# EAGLE design CameraModul (EAGLE 9.4.2)

## Sheet 1 of 2
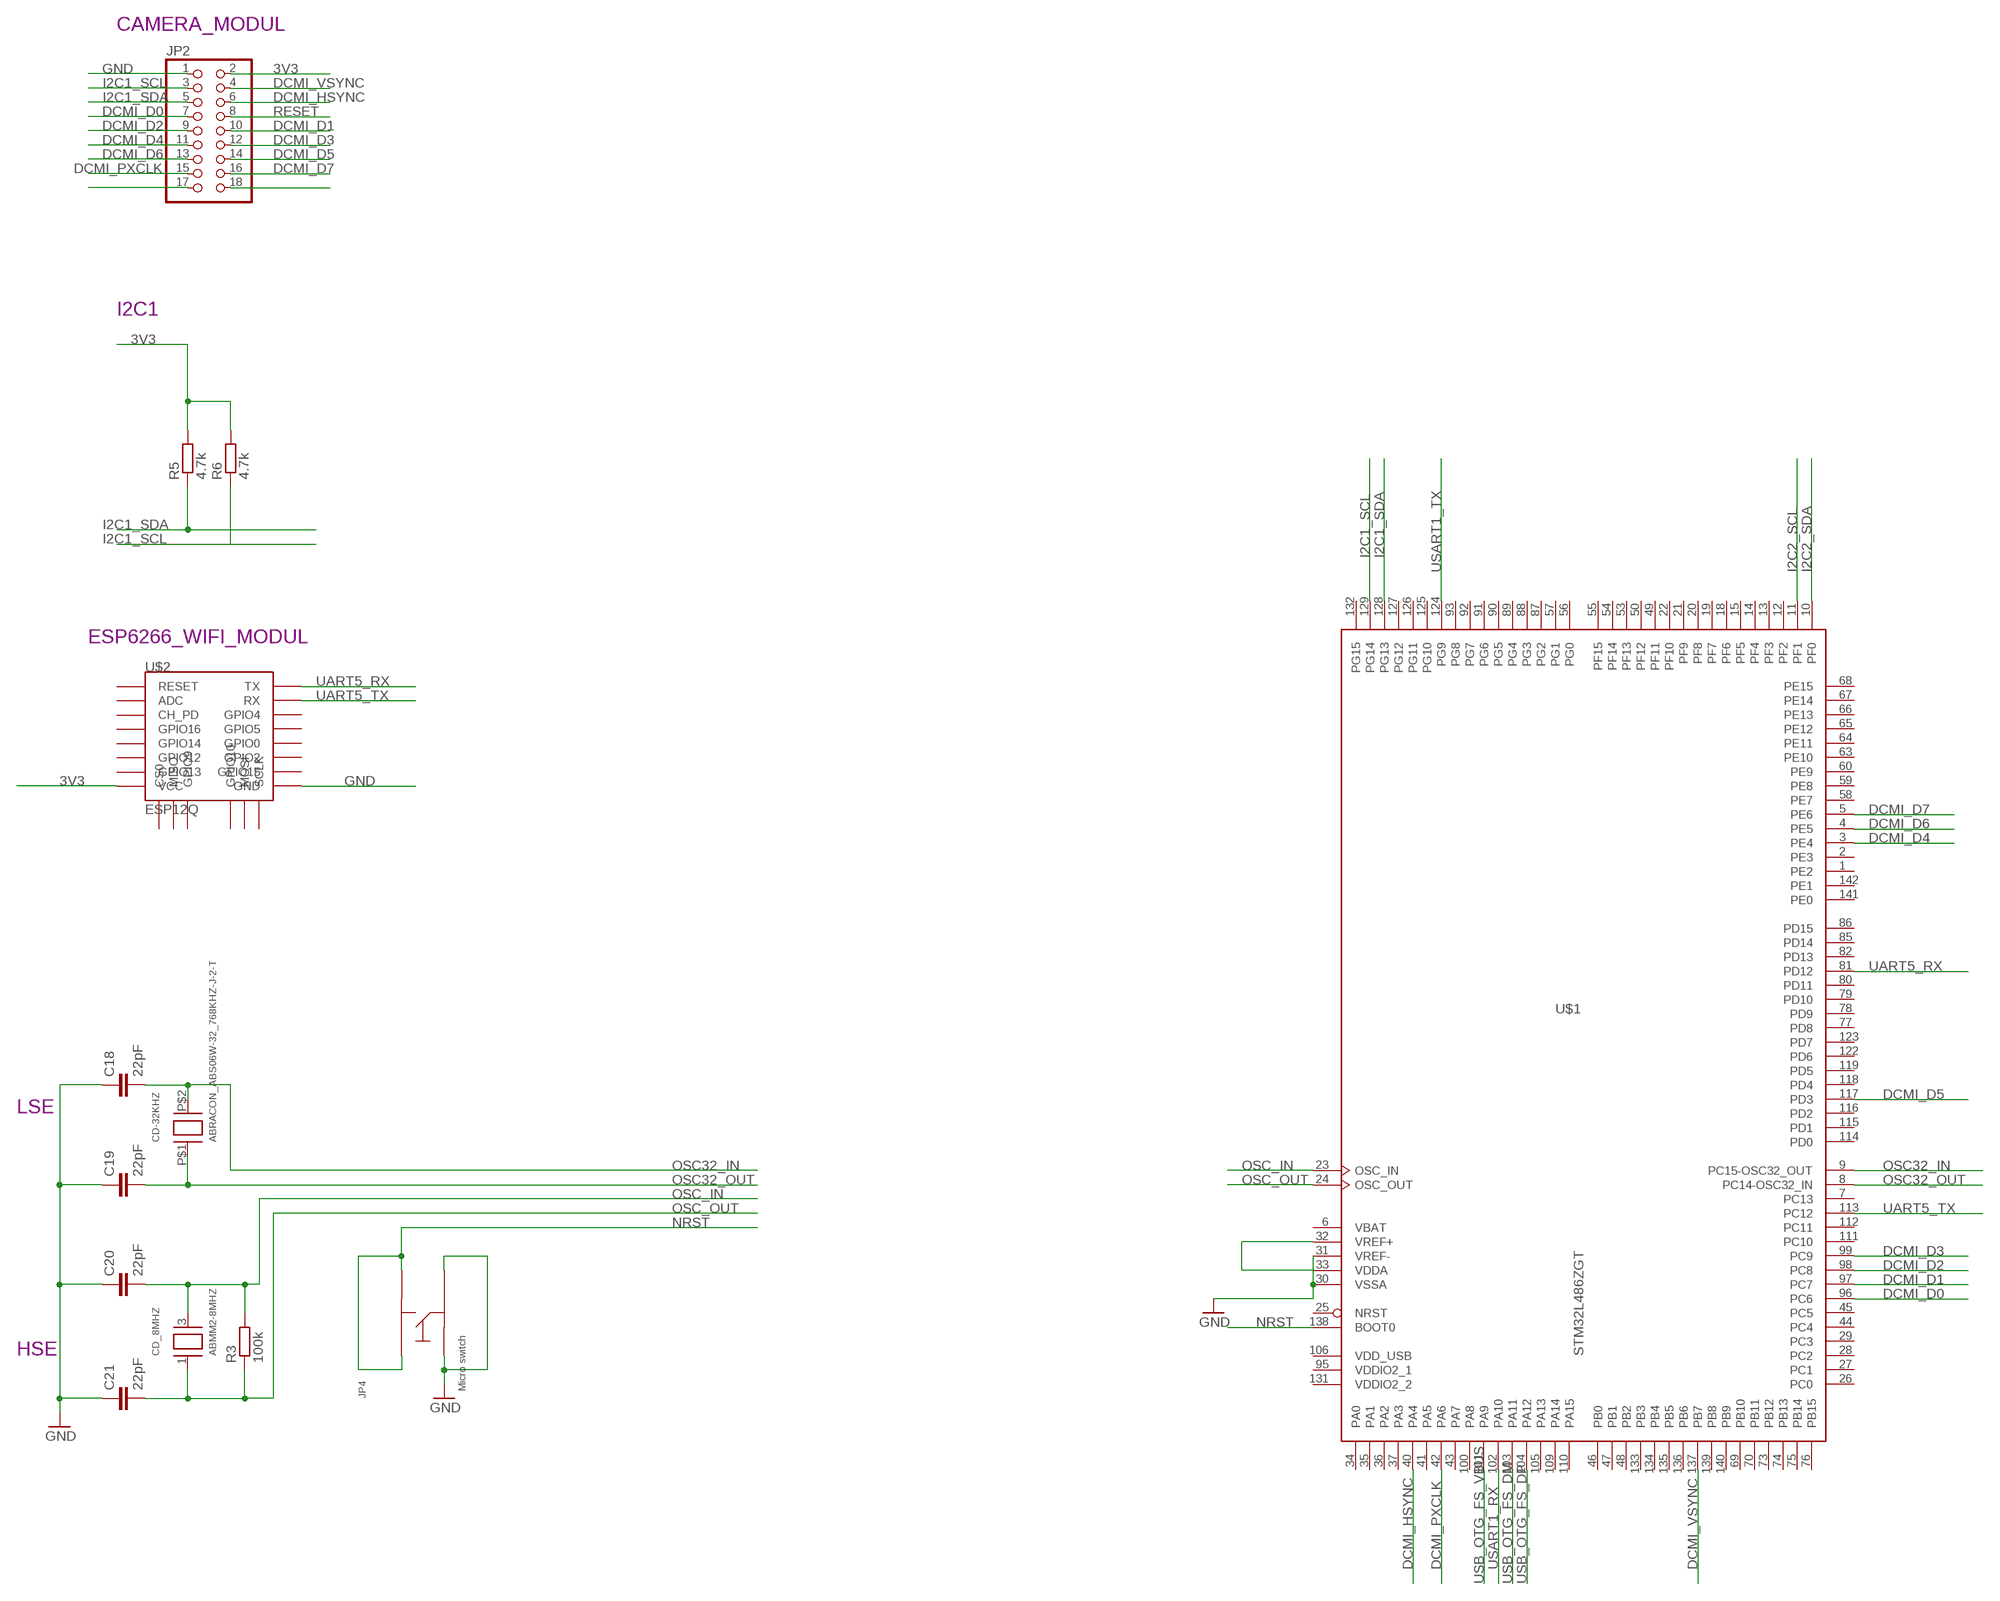
[diagram p0: schematic, sheet 1]

### Parts
C18  22pF  C-EUC0402K  [C0402K]
C19  22pF  C-EUC0402K  [C0402K]
C20  22pF  C-EUC0402K  [C0402K]
C21  22pF  C-EUC0402K  [C0402K]
CD-32KHZ  ABRACON_ABS06W-32_768KHZ-J-2-T  [2MM_X_1_2MM]
CD_8MHZ  ABMM2-8MHZ  [CRYSTAL_ABRACON_6MM_3.6MM]
JP2  PINHD-2X9  [2X09]
JP4  MICRO_SWITCH_6MM  [SKQGADE010]
R3  100k  R_0402WEB_0402  [C0402K]
R5  4.7k  R_0402WEB_0402  [C0402K]
R6  4.7k  R_0402WEB_0402  [C0402K]
U$1  STM32L486ZGT  [LQFP144]
U$2  ESP12Q  [ESP12Q]

### Nets
3V3: JP2.2 R5.2 R6.2 U$1.32(VREF+) U$1.33(VDDA) U$2.VCC ; also sheet 2
DCMI_D0: JP2.7 U$1.96(PC6)
DCMI_D1: JP2.10 U$1.97(PC7)
DCMI_D2: JP2.9 U$1.98(PC8)
DCMI_D3: JP2.12 U$1.99(PC9)
DCMI_D4: JP2.11 U$1.3(PE4)
DCMI_D5: JP2.14 U$1.117(PD3)
DCMI_D6: JP2.13 U$1.4(PE5)
DCMI_D7: JP2.16 U$1.5(PE6)
DCMI_HSYNC: JP2.6 U$1.40(PA4)
DCMI_PXCLK: JP2.15 U$1.42(PA6)
DCMI_VSYNC: JP2.4 U$1.137(PB7)
GND: C18.1 C19.1 C20.1 C21.1 JP2.1 JP4.P$3 JP4.P$4 U$1.30(VSSA) U$1.31(VREF-) U$2.GND ; also sheet 2
I2C1_SCL: JP2.3 R6.1 U$1.129(PG14)
I2C1_SDA: JP2.5 R5.1 U$1.128(PG13)
I2C2_SCL: U$1.11(PF1)
I2C2_SDA: U$1.10(PF0)
N$11: JP2.18
N$20: JP2.17
NRST: JP4.P$1 JP4.P$2 U$1.138(BOOT0)
OSC32_IN: C18.2 CD-32KHZ.P$2(C1) U$1.9(PC15-OSC32_OUT)
OSC32_OUT: C19.2 CD-32KHZ.P$1(C0) U$1.8(PC14-OSC32_IN)
OSC_IN: C20.2 CD_8MHZ.3(C1) R3.2 U$1.23(OSC_IN)
OSC_OUT: C21.2 CD_8MHZ.1(C0) R3.1 U$1.24(OSC_OUT)
RESET: JP2.8
UART5_RX: U$1.81(PD12) U$2.TX
UART5_TX: U$1.113(PC12) U$2.RX
USART1_RX: U$1.102(PA10) ; also sheet 2
USART1_TX: U$1.124(PG9) ; also sheet 2
USB_OTG_FS_DM: U$1.103(PA11) ; also sheet 2
USB_OTG_FS_DP: U$1.104(PA12) ; also sheet 2
USB_OTG_FS_VBUS: U$1.101(PA9) ; also sheet 2
Unconnected: U$1.1(PE2) U$1.2(PE3) U$1.7(PC13) U$1.12(PF2) U$1.13(PF3) U$1.14(PF4) U$1.15(PF5) U$1.18(PF6) U$1.19(PF7) U$1.20(PF8) U$1.21(PF9) U$1.22(PF10) U$1.25(NRST) U$1.26(PC0) U$1.27(PC1) U$1.28(PC2) U$1.29(PC3) U$1.34(PA0) U$1.35(PA1) U$1.36(PA2) U$1.37(PA3) U$1.41(PA5) U$1.43(PA7) U$1.44(PC4) U$1.45(PC5) U$1.46(PB0) U$1.47(PB1) U$1.48(PB2) U$1.49(PF11) U$1.50(PF12) U$1.53(PF13) U$1.54(PF14) U$1.55(PF15) U$1.56(PG0) U$1.57(PG1) U$1.58(PE7) U$1.59(PE8) U$1.60(PE9) U$1.63(PE10) U$1.64(PE11) U$1.65(PE12) U$1.66(PE13) U$1.67(PE14) U$1.68(PE15) U$1.69(PB10) U$1.70(PB11) U$1.73(PB12) U$1.74(PB13) U$1.75(PB14) U$1.76(PB15) U$1.77(PD8) U$1.78(PD9) U$1.79(PD10) U$1.80(PD11) U$1.82(PD13) U$1.85(PD14) U$1.86(PD15) U$1.87(PG2) U$1.88(PG3) U$1.89(PG4) U$1.90(PG5) U$1.91(PG6) U$1.92(PG7) U$1.93(PG8) U$1.95(VDDIO2_1) U$1.100(PA8) U$1.105(PA13) U$1.106(VDD_USB) U$1.109(PA14) U$1.110(PA15) U$1.111(PC10) U$1.112(PC11) U$1.114(PD0) U$1.115(PD1) U$1.116(PD2) U$1.118(PD4) U$1.119(PD5) U$1.122(PD6) U$1.123(PD7) U$1.125(PG10) U$1.126(PG11) U$1.127(PG12) U$1.131(VDDIO2_2) U$1.132(PG15) U$1.133(PB3) U$1.134(PB4) U$1.135(PB5) U$1.136(PB6) U$1.139(PB8) U$1.140(PB9) U$1.141(PE0) U$1.142(PE1) U$2.ADC U$2.CH_PD U$2.CS0 U$2.GPIO0 U$2.GPIO2 U$2.GPIO4 U$2.GPIO5 U$2.GPIO9 U$2.GPIO10 U$2.GPIO12 U$2.GPIO13 U$2.GPIO14 U$2.GPIO15 U$2.GPIO16 U$2.MISO U$2.MOSI U$2.RESET U$2.SCLK

### Notes on the sheet
- CAMERA_MODUL
- I2C1
- ESP6266_WIFI_MODUL
- LSE
- HSE

## Sheet 2 of 2: Device
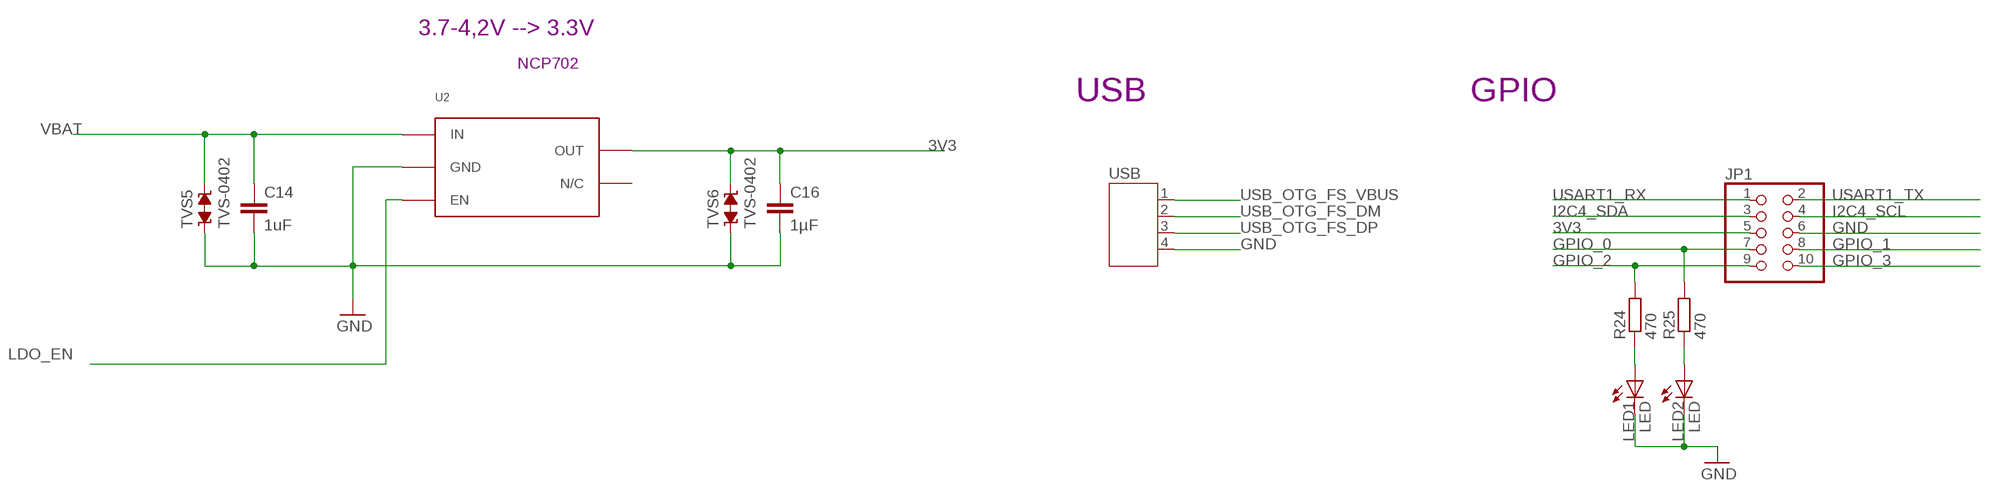
[diagram p1: schematic, sheet 2]

### Parts
C14  1uF  C-EUC0402K  [C0402K]
C16  1µF  C-EUC0402K  [C0402K]
JP1  PINHD-2X5  [2X05]
LED1  LED  [0603_AK]
LED2  LED  [0603_AK]
R24  470  R-EU_R0402  [R0402]
R25  470  R-EU_R0402  [R0402]
TVS5  TVS-0402  [TVS0402]
TVS6  TVS-0402  [TVS0402]
U2  NCP702  [SOT563]
USB  JST-PH4  [JST-PH4]

### Nets
3V3: C16.1 JP1.5 TVS6.2 U2.P$5(OUT) ; also sheet 1
GND: C14.2 C16.2 JP1.6 LED1.K(C) LED2.K(C) TVS5.1 TVS6.1 U2.P$2(GND) USB.4 ; also sheet 1
GPIO_0: JP1.7 R25.2
GPIO_1: JP1.8
GPIO_2: JP1.9 R24.2
GPIO_3: JP1.10
I2C4_SCL: JP1.4
I2C4_SDA: JP1.3
LDO_EN: U2.P$3(EN)
N$8: LED1.A R24.1
N$9: LED2.A R25.1
USART1_RX: JP1.1 ; also sheet 1
USART1_TX: JP1.2 ; also sheet 1
USB_OTG_FS_DM: USB.2 ; also sheet 1
USB_OTG_FS_DP: USB.3 ; also sheet 1
USB_OTG_FS_VBUS: USB.1 ; also sheet 1
VBAT: C14.1 TVS5.2 U2.P$1(IN)
Unconnected: U2.P$4(N/C)

### Notes on the sheet
- 3.7-4,2V --> 3.3V
- NCP702
- USB | GPIO

## Power pins joined to a net without a drawn wire
VBAT: U$1.6(VBAT)
VDD: U$1.17(VDD) U$1.39(VDD) U$1.52(VDD) U$1.62(VDD) U$1.72(VDD) U$1.84(VDD) U$1.108(VDD) U$1.121(VDD) U$1.144(VDD)
VSS: U$1.16(VSS) U$1.38(VSS) U$1.51(VSS) U$1.61(VSS) U$1.71(VSS) U$1.83(VSS) U$1.94(VSS) U$1.107(VSS) U$1.120(VSS) U$1.130(VSS) U$1.143(VSS)

## Library data of the parts
C14 C16 C18-C21 = rcl:C-EU: CAPACITOR, European symbol; SPICEPREFIX: C
CD-32KHZ = sicom_universal:ABRACON_ABS06W-32_768KHZ-J-2-T
CD_8MHZ = sicom_universal:ABMM2-8MHZ; MPN: ABMM2-8.0000MHZ-E1-T
JP1 = pinhead:PINHD-2X5: PIN HEADER
JP2 = pinhead:PINHD-2X9: PIN HEADER
JP4 = sicom_universal:MICRO_SWITCH_6MM: Micro switch, suitable for CK 6mm components DigiKey <http://www.digikey.de/product-detail/de/PTS645SH50SMTR92%20LFS/CKN9085CT-ND/1146817>; MPN: SKQGABE010
LED1 LED2 = sicom_universal:LED; MPN: LB Q39G-L2OO-35-1
R3 R5 R6 = sicom_universal:R_0402
R24 R25 = rcl:R-EU_: RESISTOR, European symbol; SPICEPREFIX: R
TVS5 TVS6 = supressor:TVS-: TVS BI-DIRECTIONAL; MPN: GG0402050R3C2P
U2 = sicom_universal:NCP702: NCP702 200 mA, Ultra-Low Quiescent Current, Ultra-Low Noise, LDO Linear Voltage Regulator Noise sensitive applications such as Phase Locked Loops, Oscillators, Frequency Synthesizers, Low Noise Amplifiers and other Precision Instrumentation require very clean power supplies. The NCP702 is a 200 mA LDO that provides the engineer with a very stable, accurate voltage with ultra−low noise and very high Power Supply Rejection Ratio (PSRR), making it suitable for RF applications. The device doesn’t require an additional noise bypass capacitor to achieve ultra−low noise performance. In order to optimize performance for battery operated portable applications, the NCP702 employs an Adaptive Ground Current feature for ultra−low ground current consumption during light−load conditions.; MANUFACTURE_NUMBER: NCP702SN33T1G; MOUSER_PART_NUMBER: 863-NCP702SN33T1G; PACKAGE: TSOP-5
U$1 = micro-stm_v3:STM32L486Z*T: ARM 32-bit Cortex™-M4 CPU 80 MHz maximum frequency 1024 Kbytes of Flash memory 128 kbytes of SRAM 115 GPIOs 1.71 to 3.6 V application supply
U$2 = esp826612q:ESP12Q: ESP8266 Wifi module 12-Q
USB = sicom_universal:JST-PH4

## Net classes
0 default: clearance 0.205 mm

## Board
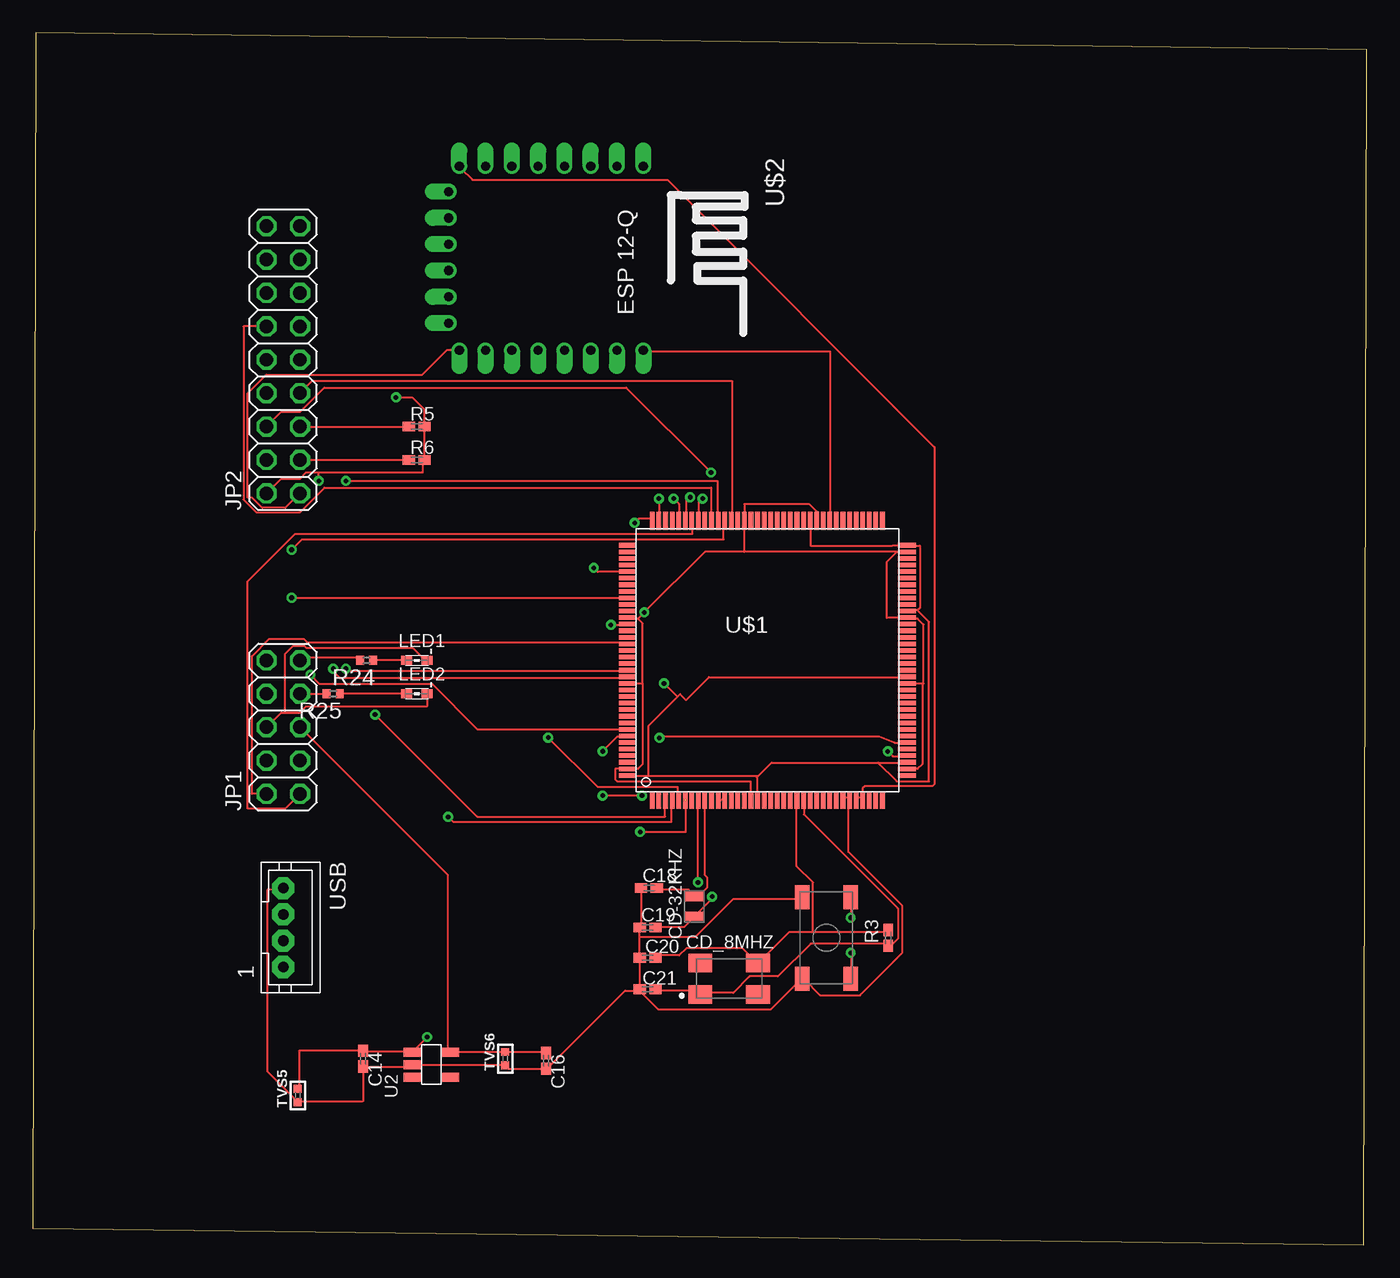
[diagram p2: board, top side]
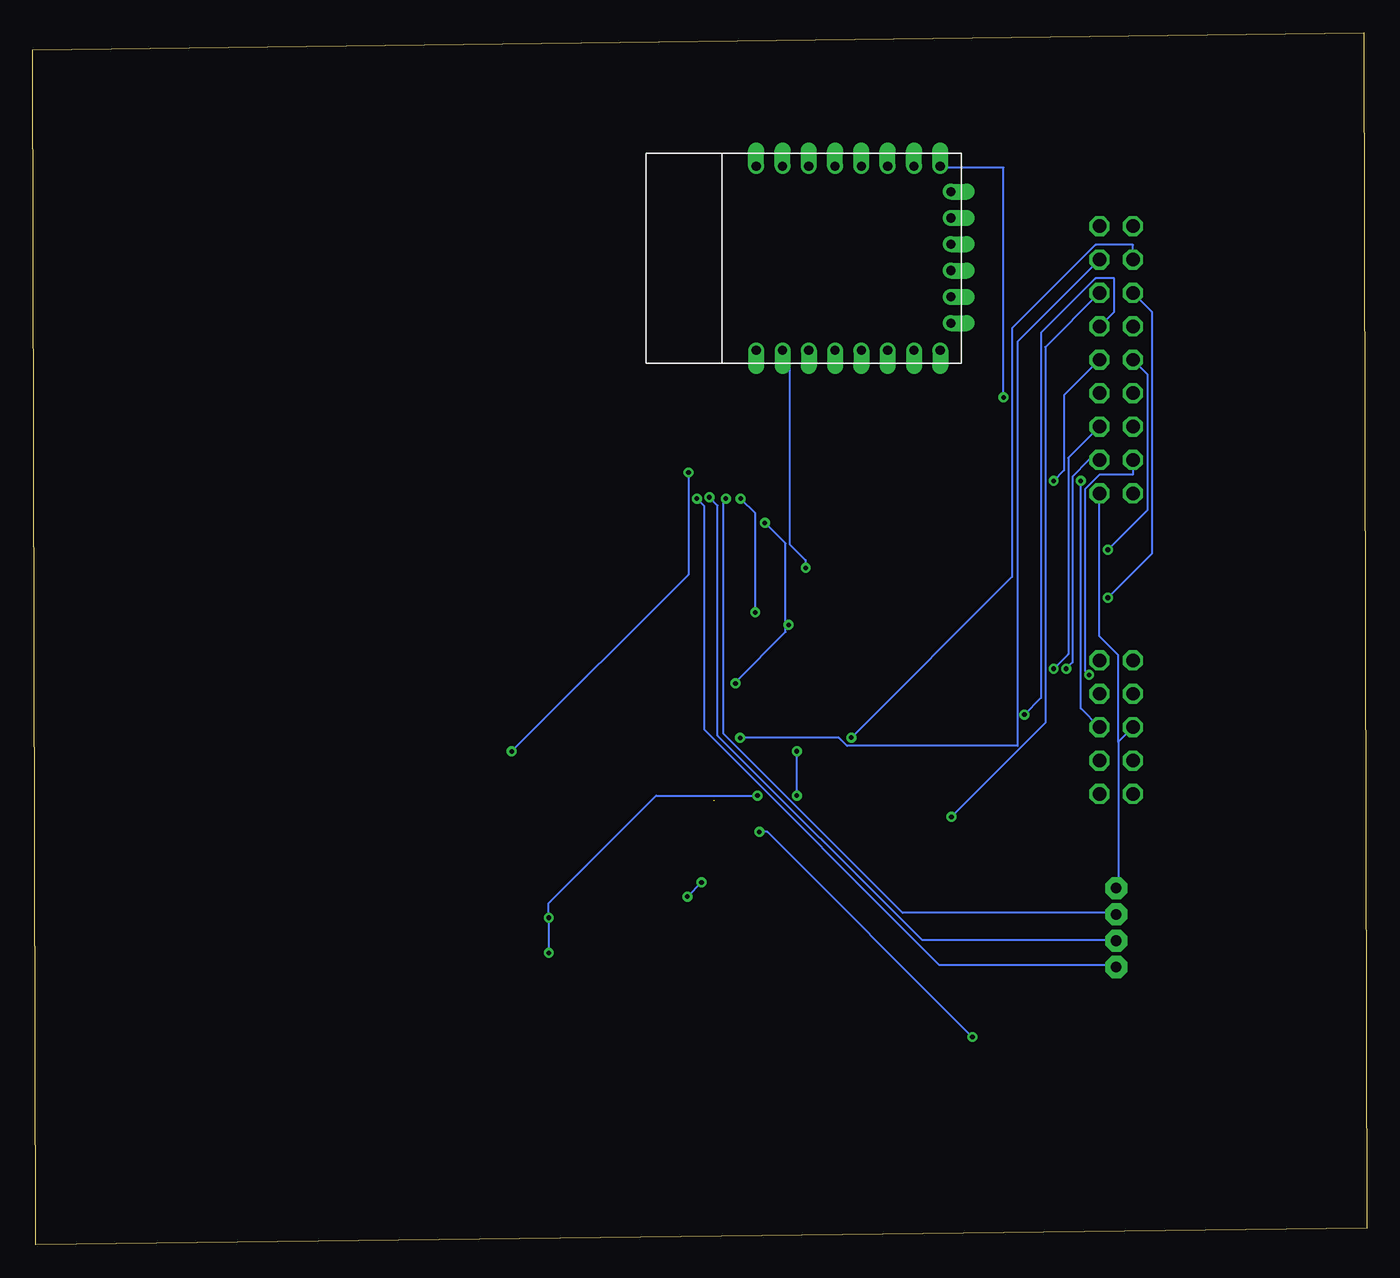
[diagram p3: board, bottom side, seen from below]

Size 101.47 x 92.17 mm. Coordinates in mm from the lower left corner, seen from the top.
Outline: 0,1.27 101.27,0 101.47,90.9 0.2,92.17 0,1.27
Copper layers (1*16): Top 0.035mm / dielectric 1.5mm / Bottom 0.035mm
Design rules "CameraModul": minimum track width 6mil, minimum drill 0.35mm, track to track 0.205mm, track to pad 0.205mm, pad to pad 0.205mm, via to via 0.205mm, smd to smd 6mil, copper to edge 20mil, drill to drill 6mil, minimum pad ring 10mil, minimum via ring 8mil, stop-mask expansion 4mil, vias tented up to drill 0mil, thermal gap 10mil

### Footprints (pad centres in the part's own frame; a part is rotated, then mirrored left to right if it is on the bottom)
C0402K = smd 0.925 x 0.74: 1 -0.6,0; 2 0.6,0
2MM_X_1_2MM = smd 0.7 x 1.4: P$1 -0.75,0; P$2 0.75,0
CRYSTAL_ABRACON_6MM_3.6MM = smd 1.8 x 1.4: 1 -2.2,-1.2; 2 2.2,-1.2; 3 2.2,1.2; 4 -2.2,1.2
2X05 = drill 1.016 octagon: 1 -5.08,-1.27; 2 -5.08,1.27; 3 -2.54,-1.27; 4 -2.54,1.27; 5 0,-1.27; 6 0,1.27; 7 2.54,-1.27; 8 2.54,1.27; 9 5.08,-1.27; 10 5.08,1.27
2X09 = drill 1.016 octagon: 1 -10.16,-1.27; 2 -10.16,1.27; 3 -7.62,-1.27; 4 -7.62,1.27; 5 -5.08,-1.27; 6 -5.08,1.27; 7 -2.54,-1.27; 8 -2.54,1.27; 9 0,-1.27; 10 0,1.27; 11 2.54,-1.27; 12 2.54,1.27; 13 5.08,-1.27; 14 5.08,1.27; 15 7.62,-1.27; 16 7.62,1.27; 17 10.16,-1.27; 18 10.16,1.27
SKQGADE010 = smd 1.8 x 1.1: P$1 -3.1,1.85; P$2 3.1,1.85; P$3 -3.1,-1.85; P$4 3.1,-1.85
0603_AK = smd 0.85 x 0.7: A -0.775,0; K 0.775,0
R0402 = smd 0.6 x 0.7: 1 -0.5,0; 2 0.5,0
TVS0402 = smd 0.6 x 0.6: 1 -0.508,0; 2 0.508,0
SOT563 = smd 0.7 x 1.4: P$1 0.95,1.4; P$2 0,1.4; P$3 -0.95,1.4; P$4 -0.95,-1.4; P$5 0.95,-1.4
LQFP144 = smd 0.35 x 1.35: 1 -8.75,-10.625; 2 -8.25,-10.625; 3 -7.75,-10.625; 4 -7.25,-10.625; 5 -6.75,-10.625; 6 -6.25,-10.625; 7 -5.75,-10.625; 8 -5.25,-10.625; 9 -4.75,-10.625; 10 -4.25,-10.625; 11 -3.75,-10.625; 12 -3.25,-10.625; 13 -2.75,-10.62; 14 -2.25,-10.625; 15 -1.75,-10.625; 16 -1.25,-10.625; 17 -0.75,-10.625; 18 -0.25,-10.625; 19 0.25,-10.625; 20 0.75,-10.625; 21 1.25,-10.625; 22 1.75,-10.625; 23 2.25,-10.625; 24 2.75,-10.62; 25 3.25,-10.625; 26 3.75,-10.625; 27 4.25,-10.625; 28 4.75,-10.625; 29 5.25,-10.625; 30 5.75,-10.625; 31 6.25,-10.625; 32 6.75,-10.625; 33 7.25,-10.625; 34 7.75,-10.625; 35 8.25,-10.625; 36 8.75,-10.625; 73 8.75,10.625; 74 8.25,10.625; 75 7.75,10.625; 76 7.25,10.625; 77 6.75,10.625; 78 6.25,10.625; 79 5.75,10.625; 80 5.25,10.625; 81 4.75,10.625; 82 4.25,10.625; 83 3.75,10.625; 84 3.25,10.625; 85 2.75,10.625; 86 2.25,10.625; 87 1.75,10.625; 88 1.25,10.625; 89 0.75,10.625; 90 0.25,10.625; 91 -0.25,10.625; 92 -0.75,10.625; 93 -1.25,10.625; 94 -1.75,10.625; 95 -2.25,10.625; 96 -2.75,10.625; 97 -3.25,10.625; 98 -3.75,10.625; 99 -4.25,10.625; 100 -4.75,10.625; 101 -5.25,10.625; 102 -5.75,10.625; 103 -6.25,10.625; 104 -6.75,10.625; 105 -7.25,10.625; 106 -7.75,10.625; 107 -8.25,10.625; 108 -8.75,10.625 | smd 1.35 x 0.35: 37 10.625,-8.75; 38 10.625,-8.25; 39 10.625,-7.75; 40 10.625,-7.25; 41 10.625,-6.75; 42 10.625,-6.25; 43 10.625,-5.75; 44 10.625,-5.25; 45 10.625,-4.75; 46 10.625,-4.25; 47 10.625,-3.75; 48 10.625,-3.25; 49 10.625,-2.75; 50 10.625,-2.25; 51 10.625,-1.75; 52 10.625,-1.25; 53 10.625,-0.75; 54 10.625,-0.25; 55 10.625,0.25; 56 10.625,0.75; 57 10.625,1.25; 58 10.625,1.75; 59 10.625,2.25; 60 10.625,2.75; 61 10.625,3.25; 62 10.625,3.75; 63 10.625,4.25; 64 10.625,4.75; 65 10.625,5.25; 66 10.625,5.75; 67 10.625,6.25; 68 10.625,6.75; 69 10.625,7.25; 70 10.625,7.75; 71 10.625,8.25; 72 10.625,8.75; 109 -10.625,8.75; 110 -10.625,8.25; 111 -10.625,7.75; 112 -10.625,7.25; 113 -10.625,6.75; 114 -10.625,6.25; 115 -10.625,5.75; 116 -10.625,5.25; 117 -10.625,4.75; 118 -10.625,4.25; 119 -10.625,3.75; 120 -10.625,3.25; 121 -10.625,2.75; 122 -10.625,2.25; 123 -10.625,1.75; 124 -10.625,1.25; 125 -10.625,0.75; 126 -10.625,0.25; 127 -10.625,-0.25; 128 -10.625,-0.75; 129 -10.625,-1.25; 130 -10.625,-1.75; 131 -10.625,-2.25; 132 -10.625,-2.75; 133 -10.625,-3.25; 134 -10.625,-3.75; 135 -10.625,-4.25; 136 -10.625,-4.75; 137 -10.625,-5.25; 138 -10.625,-5.75; 139 -10.625,-6.25; 140 -10.625,-6.75; 141 -10.625,-7.25; 142 -10.625,-7.75; 143 -10.625,-8.25; 144 -10.625,-8.75
ESP12Q = drill 0.7 offset: ADC -7.1,3.8; CH_PD -7.1,1.8; CS0 -5.165,-9.005; GND 6.9,-8.2; GPIO0 6.9,-2.2; GPIO2 6.9,-4.2; GPIO4 6.9,1.8; GPIO5 6.9,-0.2; GPIO9 -1.165,-9.005; GPIO10 0.835,-9.005; GPIO12 -7.1,-4.2; GPIO13 -7.1,-6.2; GPIO14 -7.1,-2.2; GPIO15 6.9,-6.2; GPIO16 -7.1,-0.2; MISO -3.165,-9.005; MOSI 2.835,-9.005; RESET -7.1,5.8; RX 6.9,3.8; SCLK 4.835,-9.005; TX 6.9,5.8; VCC -7.1,-8.2
JST-PH4 = drill 0.813 pad 1.676 octagon: 1 3,0; 2 1,0; 3 -1,0; 4 -3,0

### Placement (x,y rotation side)
C14  25.13,14.16 270 top
C16  39.04,13.99 270 top
C18  46.87,27.14 0 top
C19  46.77,24.14 0 top
C20  46.77,21.84 0 top
C21  46.77,19.44 0 top
CD-32KHZ  50.37,25.74 90 top
CD_8MHZ  52.97,20.24 0 top
JP1  19.05,39.37 90 top
JP2  19.05,67.31 90 top
JP4  60.37,23.34 270 top
LED1  29.21,44.45 0 top
LED2  29.21,41.91 0 top
R3  65.07,23.34 90 top
R5  29.21,62.23 0 top
R6  29.21,59.69 0 top
R24  25.4,44.45 180 top
R25  22.86,41.91 180 top
TVS5  20.15,11.36 90 top
TVS6  35.93,14.16 90 top
U2  30.31,13.7 90 top
U$1  55.88,44.45 0 top
U$2  40.64,74.93 270 top
USB  19.05,24.13 270 top

### Tracks (layer width: path | path; a pad name or v marks a point on that pad's centre or on a via)
3V3  (via drill 0.35)
  Top 0.152: R6.2 29.81,63.5 28.86,64.45 v27.62,64.45 | 21.75,58.74 20.8,58.74 20.32,58.26 18.89,58.26 JP2.2 | 21.75,58.74 29.69,58.74 29.69,59.69 R6.2 | R6.2 R5.2 | C16.1 39.11,14.66 39.1,14.67 TVS6.2 35.91,14.65 U2.P$5 31.58,14.65 31.58,28.11 JP1.5 | v21.75,58.1 21.75,58.74 | 63.11,33.99 62.75,33.99 U$1.32 | 63.11,33.99 63.11,34.71 63.29,34.88 68.44,34.88 68.59,35.04 68.59,60.67 48.28,80.99 33.45,80.99 32.55,81.88 U$2.VCC | 63.11,33.99 U$1.33
  Bottom 0.152: v27.62,64.45 27.62,81.92 32.38,81.92 U$2.VCC | v21.75,58.1 21.75,40.8 JP1.5
DCMI_D0
  Top 0.152: JP2.7 21.26,65.7 53.18,65.7 53.18,55.09 U$1.96
DCMI_D1  (via drill 0.35)
  Top 0.152: v19.69,52.86 20.48,53.66 52.55,53.66 52.55,54.93 U$1.97
  Bottom 0.152: v19.69,52.86 16.67,55.88 16.67,66.2 JP2.10
DCMI_D2  (via drill 0.35)
  Top 0.152: v23.81,58.1 52.07,58.1 52.07,55.09 U$1.98
  Bottom 0.152: v23.81,58.1 23.02,58.9 23.02,64.61 JP2.9
DCMI_D3
  Top 0.152: JP2.12 16.03,69.85 16.03,56.67 16.99,55.72 20.32,55.72 22.19,57.59 51.59,57.59 51.59,55.09 U$1.99
DCMI_D4  (via drill 0.35)
  Top 0.152: v26.04,40.32 33.8,32.56 48.1,32.56 48.1,33.81 U$1.3
  Bottom 0.152: v26.04,40.32 24.77,41.59 24.77,69.37 20.64,73.5 19.21,73.5 19.21,70.96 JP2.11
DCMI_D5  (via drill 0.35)
  Top 0.152: v19.69,49.21 45.24,49.21 U$1.117
  Bottom 0.152: v19.69,49.21 16.35,52.55 16.35,70.96 JP2.14
DCMI_D6  (via drill 0.35)
  Top 0.152: v31.59,32.54 31.99,32.14 48.58,32.14 48.58,33.81 U$1.4
  Bottom 0.152: v31.59,32.54 24.45,39.69 24.45,68.26 JP2.13
DCMI_D7  (via drill 0.35)
  Top 0.152: v39.21,38.58 42.96,34.82 49.05,34.82 49.05,33.97 U$1.5
  Bottom 0.152: v39.21,38.58 26.99,50.8 26.99,69.69 20.64,76.04 17.78,76.04 JP2.16
DCMI_HSYNC  (via drill 0.35)
  Top 0.152: v65.05,37.52 65.42,37.15 66.36,37.15 U$1.40 | v51.59,58.74 45.14,65.19 22.17,65.19 20.32,63.34 18.89,63.34 JP2.6
  Bottom 0.152: v65.05,37.52 51.59,50.98 v51.59,58.74
DCMI_PXCLK  (via drill 0.35)
  Top 0.152: v47.67,38.56 47.77,38.66 64.4,38.66 65.56,38.2 U$1.42
  Bottom 0.152: v47.67,38.56 40.15,38.56 39.53,37.94 26.57,37.94 26.57,68.68 JP2.15
DCMI_VSYNC  (via drill 0.35)
  Top 0.152: v21.11,43.34 21.79,42.66 30.36,42.66 33.81,39.21 U$1.137
  Bottom 0.152: v21.11,43.34 21.43,43.66 21.43,57.47 20.32,58.58 17.78,58.58 JP2.4
GND
  Top 0.152: U$2.GND 31.47,68.03 29.62,66.18 17.76,66.18 16.35,64.77 16.35,56.83 16.67,56.83 17.46,56.04 19.21,56.04 JP2.1 | 20.15,10.88 25.07,10.88 25.13,10.94 C14.2 28.54,13.56 28.68,13.7 U2.P$2 35.88,13.7 TVS6.1 36.19,13.39 C16.2 39.17,13.44 45.06,19.34 46.14,19.34 | LED2.K 29.98,40.96 20.8,40.96 20.32,40.48 19.21,40.48 | 19.21,40.48 18.89,40.48 JP1.6 | 19.21,40.48 19.21,44.97 19.8,45.56 20.64,45.56 20.8,45.4 28.89,45.4 29.84,44.45 LED1.K | 20.15,10.88 17.84,13.2 17.84,26.99 19.05,26.99 USB.4 | 20.15,10.88 TVS5.1 | U$1.30 61.68,33.99 62.04,33.99 U$1.31 62.04,33.81 62.04,29.88 66.15,25.77 66.15,22.2 62.93,18.98 59.9,18.98 58.64,20.23 JP4.P$4 58.47,20.23 56.14,17.91 47.57,17.91 46.14,19.34 | 46.14,23.45 46.14,22.02 C20.1 46.14,21.84 46.14,19.52 C21.1 46.14,19.34 | 46.14,23.45 46.14,23.98 C19.1 46.31,24.16 46.31,27.02 C18.1 | 46.14,23.45 50.42,23.45 53.28,26.31 58.47,26.31 JP4.P$3
  Bottom 0.152: 18.89,38.26 18.89,27.3 19.05,27.15 USB.4 | JP1.6 18.89,38.26 | JP2.1 20.32,46.28 18.89,44.85 18.89,38.26
GPIO_0
  Top 0.152: JP1.7 R25.2
GPIO_2
  Top 0.152: JP1.9 20.52,44.65 24.7,44.65 R24.2
I2C1_SCL  (via drill 0.35)
  Top 0.152: JP2.3 R6.1 | U$1.129 45.13,43.08 23.4,43.08 22.86,43.62 v22.86,43.81
  Bottom 0.152: v22.86,43.81 22.38,44.29 22.38,58.42 21.11,59.69 JP2.3
I2C1_SDA  (via drill 0.35)
  Top 0.152: JP2.5 R5.1 | v23.81,43.81 23.97,43.66 45.24,43.66 U$1.128
  Bottom 0.152: v23.81,43.81 22.7,44.93 22.7,59.85 JP2.5
I2C2_SCL
  Top 0.152: U$1.11 52.35,33.83 52.67,34.14
N$8
  Top 0.152: LED1.A R24.1
N$9
  Top 0.152: LED2.A R25.1
NRST  (via drill 0.35)
  Top 0.152: v62.22,22.2 62.22,20.41 JP4.P$2 | v62.22,24.88 62.22,26.31 JP4.P$1 | v43.34,37.54 44.47,38.66 45.22,38.66 U$1.138 | v46.34,34.16 v43.34,34.16
  Bottom 0.152: v62.22,22.2 v62.22,24.88 62.22,25.99 54.05,34.16 v46.34,34.16 | v43.34,34.16 v43.34,37.54
OSC32_IN
  Top 0.152: C18.2 47.57,27.02 49.89,27.02 50.25,26.66 CD-32KHZ.P$2 50.42,26.66 50.78,26.66 51.32,27.2 51.32,27.91 51.14,28.09 U$1.9
OSC32_OUT  (via drill 0.35)
  Top 0.152: C19.2 47.39,24.16 49.53,24.16 50.25,24.88 CD-32KHZ.P$1 50.42,25.06 51.68,26.31 v51.68,26.49 | v50.6,27.56 50.6,33.81 U$1.8
  Bottom 0.152: v51.68,26.49 v50.6,27.56
OSC_IN
  Top 0.152: C20.2 47.39,22.02 49.17,22.02 49.71,22.55 54,22.55 55.07,21.48 CD_8MHZ.3 55.25,21.48 57.57,23.8 59.36,23.8 | 59.36,23.8 64.9,23.8 R3.2 | 59.36,23.8 59.36,27.56 58.11,28.81 58.11,33.81 U$1.23
OSC_OUT
  Top 0.152: C21.2 47.39,19.34 50.42,19.34 50.6,19.16 CD_8MHZ.1 50.78,19.16 53.28,19.16 54.53,20.41 56.68,20.41 59.18,22.91 64.9,22.91 R3.1 65.08,22.91 65.44,22.91 65.79,23.27 65.79,25.59 58.64,32.74 58.64,33.81 U$1.24
UART5_RX
  Top 0.152: U$1.81 60.64,55.09 60.64,67.95 46.51,67.95 U$2.TX
UART5_TX  (via drill 0.35)
  Top 0.152: v42.67,51.48 42.97,51.18 45.23,51.18 U$1.113
  Bottom 0.152: v42.67,51.48 42.67,52.08 43.89,53.29 43.89,67.72 U$2.RX
USART1_RX
  Top 0.152: JP1.1 19.21,33.18 16.35,33.18 16.35,50.48 19.94,54.07 50.16,54.07 50.16,54.93 U$1.102
USART1_TX
  Top 0.152: JP1.2 16.67,34.29 16.67,44.77 17.98,46.08 20.6,46.08 20.86,45.82 45.19,45.82 U$1.124
USB_OTG_FS_DM  (via drill 0.35)
  Top 0.152: v50.01,56.86 49.69,56.86 49.69,55.09 U$1.103
  Bottom 0.152: v50.01,56.86 49.37,56.22 49.37,38.73 33.81,23.18 19.05,23.18 USB.2
USB_OTG_FS_DP  (via drill 0.35)
  Top 0.152: v48.75,56.76 49.15,56.36 49.15,55.1 U$1.104
  Bottom 0.152: v48.75,56.76 48.95,56.56 48.95,38.89 35.3,25.24 19.05,25.24 USB.3
USB_OTG_FS_VBUS  (via drill 0.35)
  Top 0.152: v50.96,56.76 50.64,56.76 50.64,55.09 U$1.101
  Bottom 0.152: v50.96,56.76 50.39,56.19 50.39,39.18 32.48,21.27 19.05,21.27 USB.1
VBAT  (via drill 0.35)  (1 unrouted)
  Top 0.152: 20.15,11.84 TVS5.2 20.25,11.96 | 49.69,33.81 49.69,31.41 v46.2,31.41 | v29.99,15.8 28.91,14.72 U2.P$1 28.9,14.69 25.2,14.69 C14.1 20.25,14.76 20.25,11.96 | 20.25,11.97 20.25,11.96
  Bottom 0.152: v46.2,31.41 45.6,31.41 v29.99,15.8
VDD  (via drill 0.35)
  Top 0.152: 67.31,48.26 66.52,48.26 U$1.62 | 67.31,48.26 67.47,48.42 67.47,53.18 66.52,53.18 U$1.72 65.41,53.2 65.36,53.14 59.21,53.14 59.21,54.93 U$1.84 | 46.83,35.66 45.3,35.66 U$1.144 | 46.83,35.66 55.19,35.66 | U$1.17 55.09,33.97 55.09,35.56 55.19,35.66 | 64.29,36.67 56.2,36.67 55.19,35.66 | 64.29,36.67 66.36,36.67 U$1.39 | 49.04,41.68 46.83,39.48 46.83,35.66 | 49.04,41.68 49.24,41.88 49.69,41.43 51.44,43.18 66.36,43.18 U$1.52 | v43.97,47.15 45.24,47.15 U$1.121 | 49.04,41.68 v48.02,42.7 | U$1.108 46.99,55.21 46.08,55.21 v45.78,54.91 | 67.31,48.26 68.19,47.38 68.19,35.24 65.72,35.24 64.29,36.67
  Bottom 0.152: v48.02,42.7 48.02,42.8 44.21,46.61 44.21,46.91 | 44.21,46.91 v43.97,47.15 | v45.78,54.91 44.21,53.34 44.21,46.91
VSS  (via drill 0.35)
  Top 0.152: 46.4,42.7 46.4,36.55 46.04,36.2 45.4,36.2 U$1.143 44.29,36.2 44.29,35.4 44.45,35.24 54.61,35.24 54.61,33.97 U$1.16 | 46.4,42.7 45.4,42.7 U$1.130 | 46.04,47.62 45.4,47.62 U$1.120 | 46.04,47.62 46.4,47.27 46.4,42.7 | v47.62,56.76 47.62,55.09 U$1.107 | 46.04,47.62 v46.51,48.1 51.12,52.7 54.13,52.7 | U$1.83 59.69,55.09 59.69,55.72 59.07,56.34 54.13,56.34 54.13,55.09 U$1.94 54.13,54.93 54.13,52.7 | 67.67,42.7 67.67,36.55 67.31,36.2 66.52,36.2 U$1.38 | 67.67,42.7 66.52,42.7 U$1.51 | 67.67,42.7 67.77,42.7 67.77,47.17 67.31,47.62 66.52,47.62 U$1.61 66.49,47.68 64.96,47.68 64.96,51.95 65.72,52.7 | 65.72,52.7 66.36,52.7 U$1.71 | 65.72,52.7 54.13,52.7
  Bottom 0.152: v47.62,56.76 46.51,55.64 v46.51,48.1